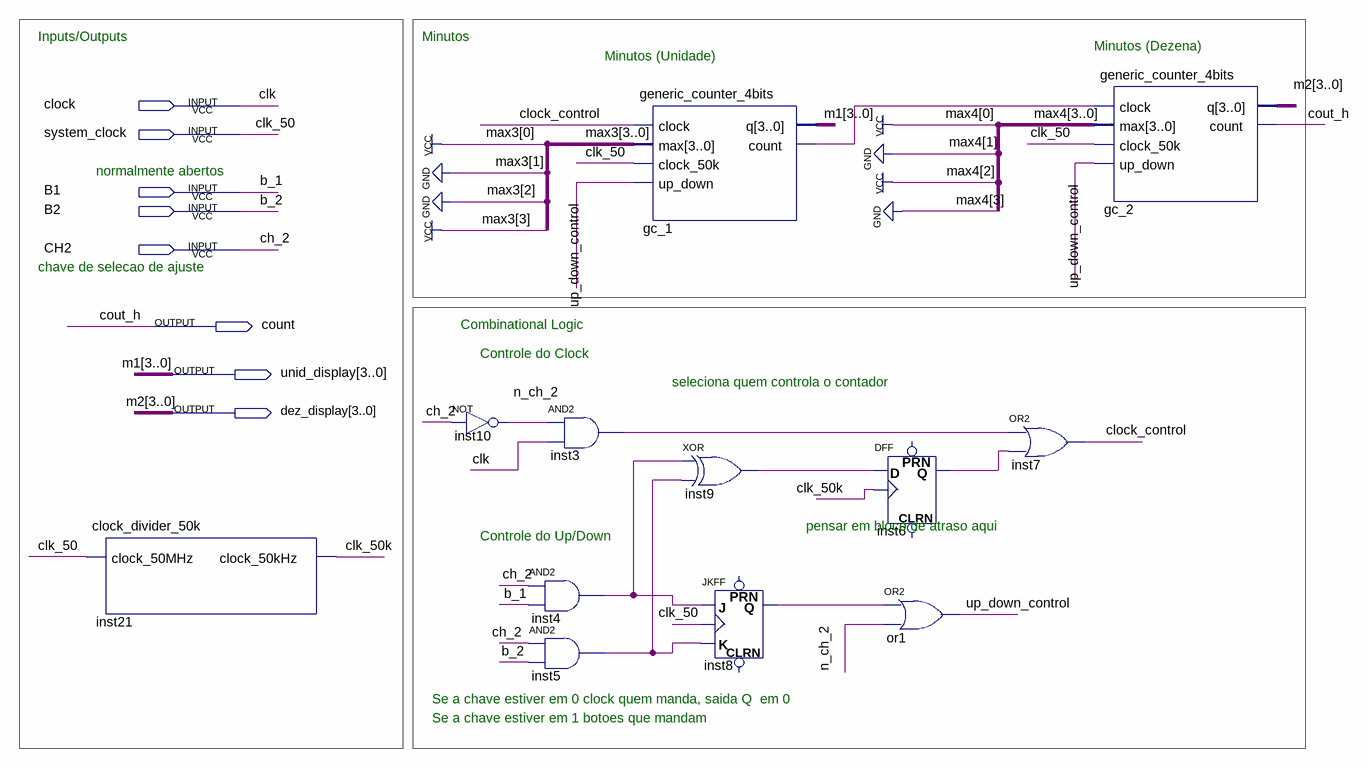
[diagram p0: schematic sheet]
// Quartus schematic minutes_block.bdf as structural Verilog: 12 symbols, 8 pins
module minutes_block (
  input  clock,
  input  system_clock,
  input  B1,
  input  B2,
  input  CH2,
  output count,
  output [3:0] unid_display,
  output [3:0] dez_display
);

  wire clk_50k, clock_control, gc_1_count, inst3_out, inst4_out, inst5_out, inst6_q, inst8_q, inst9_out,
       n_ch_2, up_down_control;

  clock_divider_50k inst21 (.clock_50MHz(system_clock), .clock_50kHz(clk_50k));
  not inst10 (n_ch_2, CH2);
  and inst3 (inst3_out, n_ch_2, clock);
  and inst4 (inst4_out, CH2, B1);
  and inst5 (inst5_out, CH2, B2);
  generic_counter_4bits gc_1 (
    .clock(clock_control), .max(4'b1001), .clock_50k(system_clock), .up_down(up_down_control),
    .q(unid_display), .count(gc_1_count));
  xor inst9 (inst9_out, inst4_out, inst5_out);
  JKFF inst8 (.K(inst5_out), .J(inst4_out), .CLK(system_clock), .Q(inst8_q));  // open: PRN, CLRN
  DFF inst6 (.CLK(clk_50k), .D(inst9_out), .Q(inst6_q));  // open: CLRN, PRN
  or or1 (up_down_control, inst8_q, n_ch_2);
  or inst7 (clock_control, inst3_out, inst6_q);
  generic_counter_4bits gc_2 (
    .clock(gc_1_count), .max(4'b0101), .clock_50k(system_clock), .up_down(up_down_control), .q(dez_display),
    .count(count));

  // Other names for the same wires on the sheet: b_1 = B1; b_2 = B2; ch_2 = CH2; clk = clock; clk_50 = system_clock;
  //   cout_h = count; m1[3:0] = unid_display; m2[3:0] = dez_display

  // Notes on the sheet:
  //   Inputs/Outputs
  //   Minutos
  //   Minutos (Dezena)
  //   Minutos (Unidade)
  //   normalmente abertos
  //   chave de selecao de ajuste
  //   Combinational Logic
  //   Controle do Clock
  //   seleciona quem controla o contador
  //   pensar em bloco de atraso aqui
  //   Controle do Up/Down
  //   Se a chave estiver em 0 clock quem manda, saida Q  em 0
  //   Se a chave estiver em 1 botoes que mandam
endmodule
